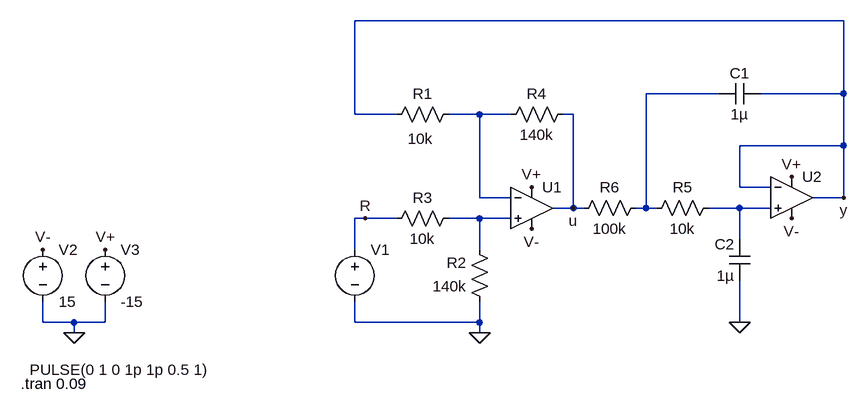
[diagram p0: schematic E3_3.asc]
E3_3.asc, the LTspice schematic file:
Version 4
SHEET 1 880 680
WIRE 672 -176 -80 -176
WIRE 480 -64 368 -64
WIRE 672 -64 672 -176
WIRE 672 -64 544 -64
WIRE -80 -32 -80 -176
WIRE -16 -32 -80 -32
WIRE 112 -32 64 -32
WIRE 160 -32 112 -32
WIRE 256 -32 240 -32
WIRE 672 16 672 -64
WIRE 672 16 512 16
WIRE 512 80 512 16
WIRE 560 80 512 80
WIRE 112 96 112 -32
WIRE 160 96 112 96
WIRE 672 96 672 16
WIRE 672 96 624 96
WIRE 256 112 256 -32
WIRE 256 112 224 112
WIRE 272 112 256 112
WIRE 368 112 368 -64
WIRE 368 112 352 112
WIRE 384 112 368 112
WIRE 512 112 464 112
WIRE 560 112 512 112
WIRE -64 128 -80 128
WIRE -16 128 -64 128
WIRE 112 128 64 128
WIRE 160 128 112 128
WIRE 512 160 512 112
WIRE -80 176 -80 128
WIRE 112 176 112 128
WIRE -560 288 -560 256
WIRE -512 288 -560 288
WIRE -464 288 -464 256
WIRE -464 288 -512 288
WIRE -80 288 -80 256
WIRE 112 288 112 256
WIRE 112 288 -80 288
WIRE 512 288 512 224
WIRE -512 304 -512 288
WIRE 112 304 112 288
FLAG 112 304 0
FLAG 512 288 0
FLAG -512 304 0
FLAG 256 112 u
FLAG 672 96 y
FLAG -64 128 R
FLAG -464 176 V+
FLAG -560 176 V-
FLAG 192 80 V+
FLAG 592 64 V+
FLAG 192 144 V-
FLAG 592 128 V-
SYMBOL OpAmps\\UniversalOpamp 192 112 R0
SYMATTR InstName U1
SYMBOL OpAmps\\UniversalOpamp 592 96 R0
SYMATTR InstName U2
SYMBOL res 256 -48 R90
WINDOW 0 0 56 VBottom 2
WINDOW 3 32 56 VTop 2
SYMATTR InstName R4
SYMATTR Value 140k
SYMBOL res 80 -48 R90
WINDOW 0 0 56 VBottom 2
WINDOW 3 38 59 VTop 2
SYMATTR InstName R1
SYMATTR Value 10k
SYMBOL res 80 112 R90
WINDOW 0 0 56 VBottom 2
WINDOW 3 32 56 VTop 2
SYMATTR InstName R3
SYMATTR Value 10k
SYMBOL res 128 272 R180
WINDOW 0 36 76 Left 2
WINDOW 3 36 40 Left 2
SYMATTR InstName R2
SYMATTR Value 140k
SYMBOL res 368 128 R270
WINDOW 0 32 56 VTop 2
WINDOW 3 0 56 VBottom 2
SYMATTR InstName R5
SYMATTR Value 10k
SYMBOL cap 544 -80 R90
WINDOW 0 0 32 VBottom 2
WINDOW 3 32 32 VTop 2
SYMATTR InstName C1
SYMATTR Value 1µ
SYMBOL cap 528 224 R180
WINDOW 0 24 56 Left 2
WINDOW 3 24 8 Left 2
SYMATTR InstName C2
SYMATTR Value 1µ
SYMBOL res 256 128 R270
WINDOW 0 32 56 VTop 2
WINDOW 3 0 56 VBottom 2
SYMATTR InstName R6
SYMATTR Value 100k
SYMBOL voltage -80 160 R0
WINDOW 3 -500 201 Left 2
WINDOW 123 0 0 Left 0
WINDOW 39 0 0 Left 0
SYMATTR Value PULSE(0 1 0 1p 1p 0.5 1)
SYMATTR InstName V1
SYMBOL voltage -560 160 R0
WINDOW 123 0 0 Left 0
WINDOW 39 0 0 Left 0
SYMATTR InstName V2
SYMATTR Value 15
SYMBOL voltage -464 160 R0
WINDOW 123 0 0 Left 0
WINDOW 39 0 0 Left 0
SYMATTR InstName V3
SYMATTR Value -15
TEXT -594 382 Left 2 !.tran 0.09

The netlist it stands for:
* E3_3.asc
XU1 N004 N002 V+ V- u level1 Avol=1Meg GBW=10Meg Vos=0 En=0 Enk=0 In=0 Ink=0 Rin=500Meg  ; pins In+ In- V+ V- OUT
XU2 N003 y V+ V- y level1 Avol=1Meg GBW=10Meg Vos=0 En=0 Enk=0 In=0 Ink=0 Rin=500Meg  ; pins In+ In- V+ V- OUT
R4 u N002 140k
R1 N002 y 10k
R3 N004 R 10k
R2 0 N004 140k
R5 N001 N003 10k
C1 y N001 1µ
C2 0 N003 1µ
R6 u N001 100k
V1 R 0 PULSE(0 1 0 1p 1p 0.5 1)
V2 V- 0 15
V3 V+ 0 -15
.tran 0.09
.lib UniversalOpAmp1.lib
.backanno
.end

* Results of the author's LTspice run, read from the files saved beside the schematic
* Operating Point, zero values left out:
*   V(v+) = -15 V
*   V(v-) = 15 V
*   I(V3) = 3 mA
*   I(V2) = -3 mA
*   Ix(u1:3) = -1.5 mA
*   Ix(u1:4) = 1.5 mA
*   Ix(u2:3) = -1.5 mA
*   Ix(u2:4) = 1.5 mA
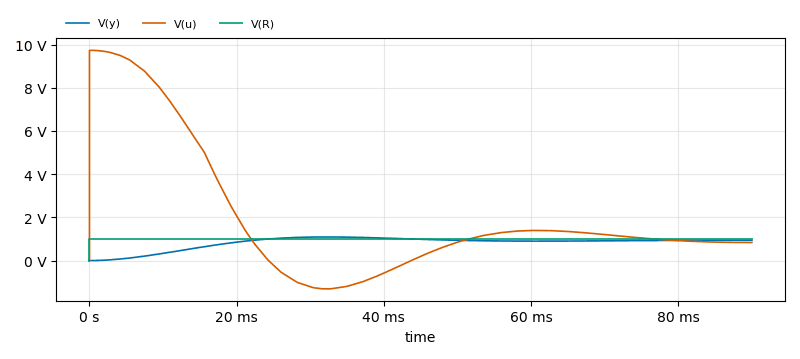
[diagram p1: Transient Analysis of E3_3.asc, plotted from the saved traces]
* Transient Analysis, 1 run:
*   V(y): min -10.09 µV, max 1.093 V, average 830.6 mV, rms 878.7 mV, last 940.1 mV
*   V(u): min -1.306 V, max 9.731 V, average 1.98 V, rms 3.666 V, last 838.1 mV
*   V(R): min 0 V, max 1 V, average 1 V, rms 1 V, last 1 V